# EAGLE design Печатная плата принимающая (EAGLE 9.0.0)
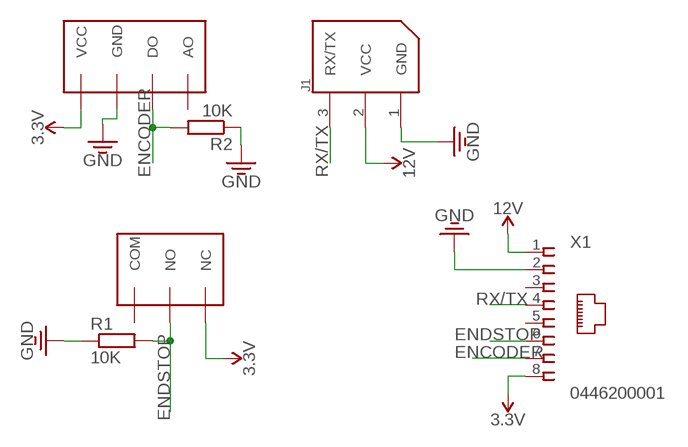
[diagram p0: schematic, sheet 1]

## Parts
J1  22-03-5035  [5267-3]
R1  10K  R-EU_0204/7  [0204/7]
R2  10K  R-EU_0204/7  [0204/7]
U$1  OPTICAL_ENCODER_FC-01  [OPTICAL_ENCODER_FC-01]
U$2  ENDSTOP  [ENDSTOP]
X1  0446200001  [0446200001]

## Nets
3.3V: U$1.VCC U$2.NC X1.8
12V: J1.2(VCC) X1.1
ENCODER: R2.2 U$1.DO X1.7
ENDSTOP: R1.2 U$2.NO X1.6
GND: J1.1(GND) R1.1 R2.1 U$1.GND X1.2
RX/TX: J1.3(RX/TX) X1.4
Unconnected: U$1.AO U$2.COM X1.3 X1.5

## Library data of the parts
J1 = molex:22-03-5035: Molex SPOX Vert, Tin (Dynamixel AX/MX Bus) tested: YES (arbotix)
R1 R2 = resistor:R-EU_: RESISTOR, European symbol
U$1 = other components:OPTICAL_ENCODER_FC-01
U$2 = other components:ENDSTOP
X1 = con-molex:0446200001: RJ-45 INVERTED MODULAR JACK ASSEMBLY WITH RJ-11 KEEPOUT FEATURE Source: Data sheet <http://www.farnell.com/datasheets/73207.pdf>; MF: MOLEX; OC_FARNELL: unknown

## Board
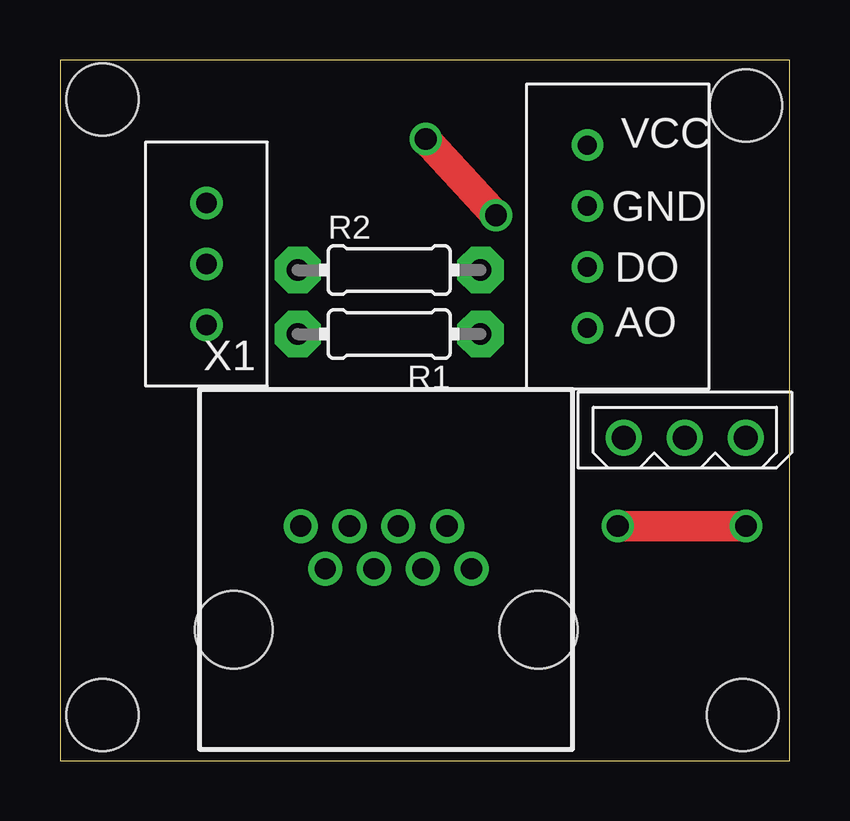
[diagram p1: board, top side]
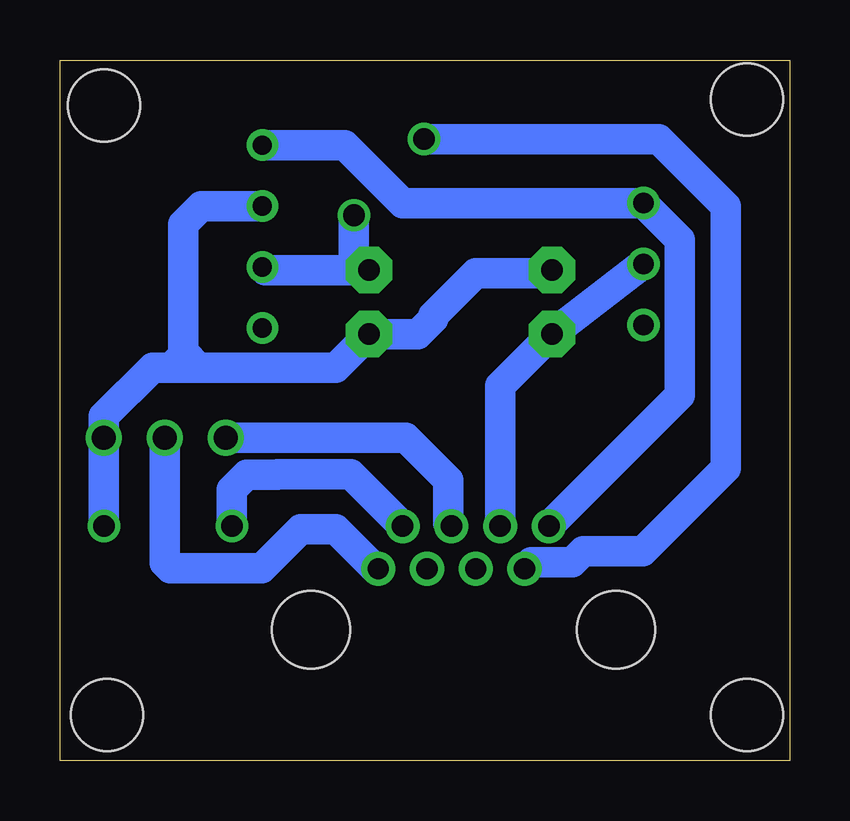
[diagram p2: board, bottom side, seen from below]

Size 30.4 x 29.2 mm. Coordinates in mm from the lower left corner, seen from the top.
Outline: 0,0 30.4,0 30.4,29.2 0,29.2 0,0
Copper layers (1*16): Top 0.035mm / dielectric 1.5mm / Bottom 0.035mm
Design rules "default": minimum track width 6mil, minimum drill 0.35mm, track to track 6mil, track to pad 6mil, pad to pad 6mil, via to via 6mil, smd to smd 6mil, copper to edge 40mil, drill to drill 6mil, minimum pad ring 10mil, minimum via ring 8mil, stop-mask expansion 4mil, vias tented up to drill 0mil, thermal gap 10mil
Holes 3 mm at 1.78,27.56 1.78,1.91 28.45,1.91 28.57,27.3

### Footprints (pad centres in the part's own frame; a part is rotated, then mirrored left to right if it is on the bottom)
5267-3 = drill 1: 1 0,0; 2 -2.54,0; 3 -5.08,0
0204/7 = drill 0.9 pad 1.93 octagon: 1 -3.81,0; 2 3.81,0
OPTICAL_ENCODER_FC-01 = drill 0.8: AO 2.54,0; DO 0,0; GND -2.54,0; VCC -5.08,0
ENDSTOP = drill 0.85: COM -7.62,0; NC -2.54,0; NO -5.08,0
0446200001 = drill 0.889 pad 1.422: 1 3.556,2.54; 2 2.54,4.318; 3 1.524,2.54; 4 0.508,4.318; 5 -0.508,2.54; 6 -1.524,4.318; 7 -2.54,2.54; 8 -3.556,4.318 | hole 3.251: 6.35,0; -6.35,0

### Placement (x,y rotation side)
J1  28.57,13.46 0 top
R1  13.72,17.78 180 top
R2  13.72,20.45 0 top
U$1  21.97,20.57 270 top
U$2  6.1,25.78 90 top
X1  13.59,5.46 0 top

### Tracks (layer width: path | path; a pad name or v marks a point on that pad's centre or on a via)
3.3V
  Bottom 1.27: U$1.VCC 18.54,25.65 16.13,23.24 U$2.NC 4.57,21.72 4.57,15.24 X1.8
12V
  Bottom 1.27: J1.2 26.04,8.26 25.81,8.03 22,8.03 20.38,9.65 18.92,9.65 17.27,8 X1.1
ENCODER  (via drill 0.9)
  Top 1.27: v15.24,25.91 v18.16,22.73
  Bottom 1.27: R2.2 18.16,20.45 | 18.16,20.45 21.84,20.45 U$1.DO | v18.16,22.73 18.16,20.45 | v15.24,25.91 5.46,25.91 2.67,23.11 2.67,12.19 6.12,8.74 8.6,8.74 9.05,8.28 10.77,8.28 X1.7
ENDSTOP
  Bottom 0.813: 12.06,10.03 X1.6
  Bottom 1.27: 12.06,10.03 12.06,15.62 R1.2 U$2.NO
GND  (via drill 0.9)
  Top 1.27: v23.24,9.78 v28.57,9.78
  Bottom 1.27: R2.1 10.03,20.32 13.08,20.32 14.86,18.54 14.86,18.41 15.49,17.78 R1.1 18.92,16.38 24.64,16.38 | 24.64,16.38 25.78,16.38 | 25.78,16.38 26.54,16.38 28.57,14.35 J1.1 v28.57,9.78 | U$1.GND 24.51,23.11 25.27,22.35 25.27,17.02 | 25.27,17.02 24.64,16.38 | 25.27,17.02 25.27,16.89 25.78,16.38 | X1.2 18.29,11.94 21.34,11.94 21.35,11.92 22.62,11.92 23.24,11.3 v23.24,9.78
RX/TX
  Bottom 1.27: X1.4 14.22,9.91 14.22,11.68 16,13.46 J1.3